# EAGLE design 3port-PicoUPS (EAGLE 8.2.2)
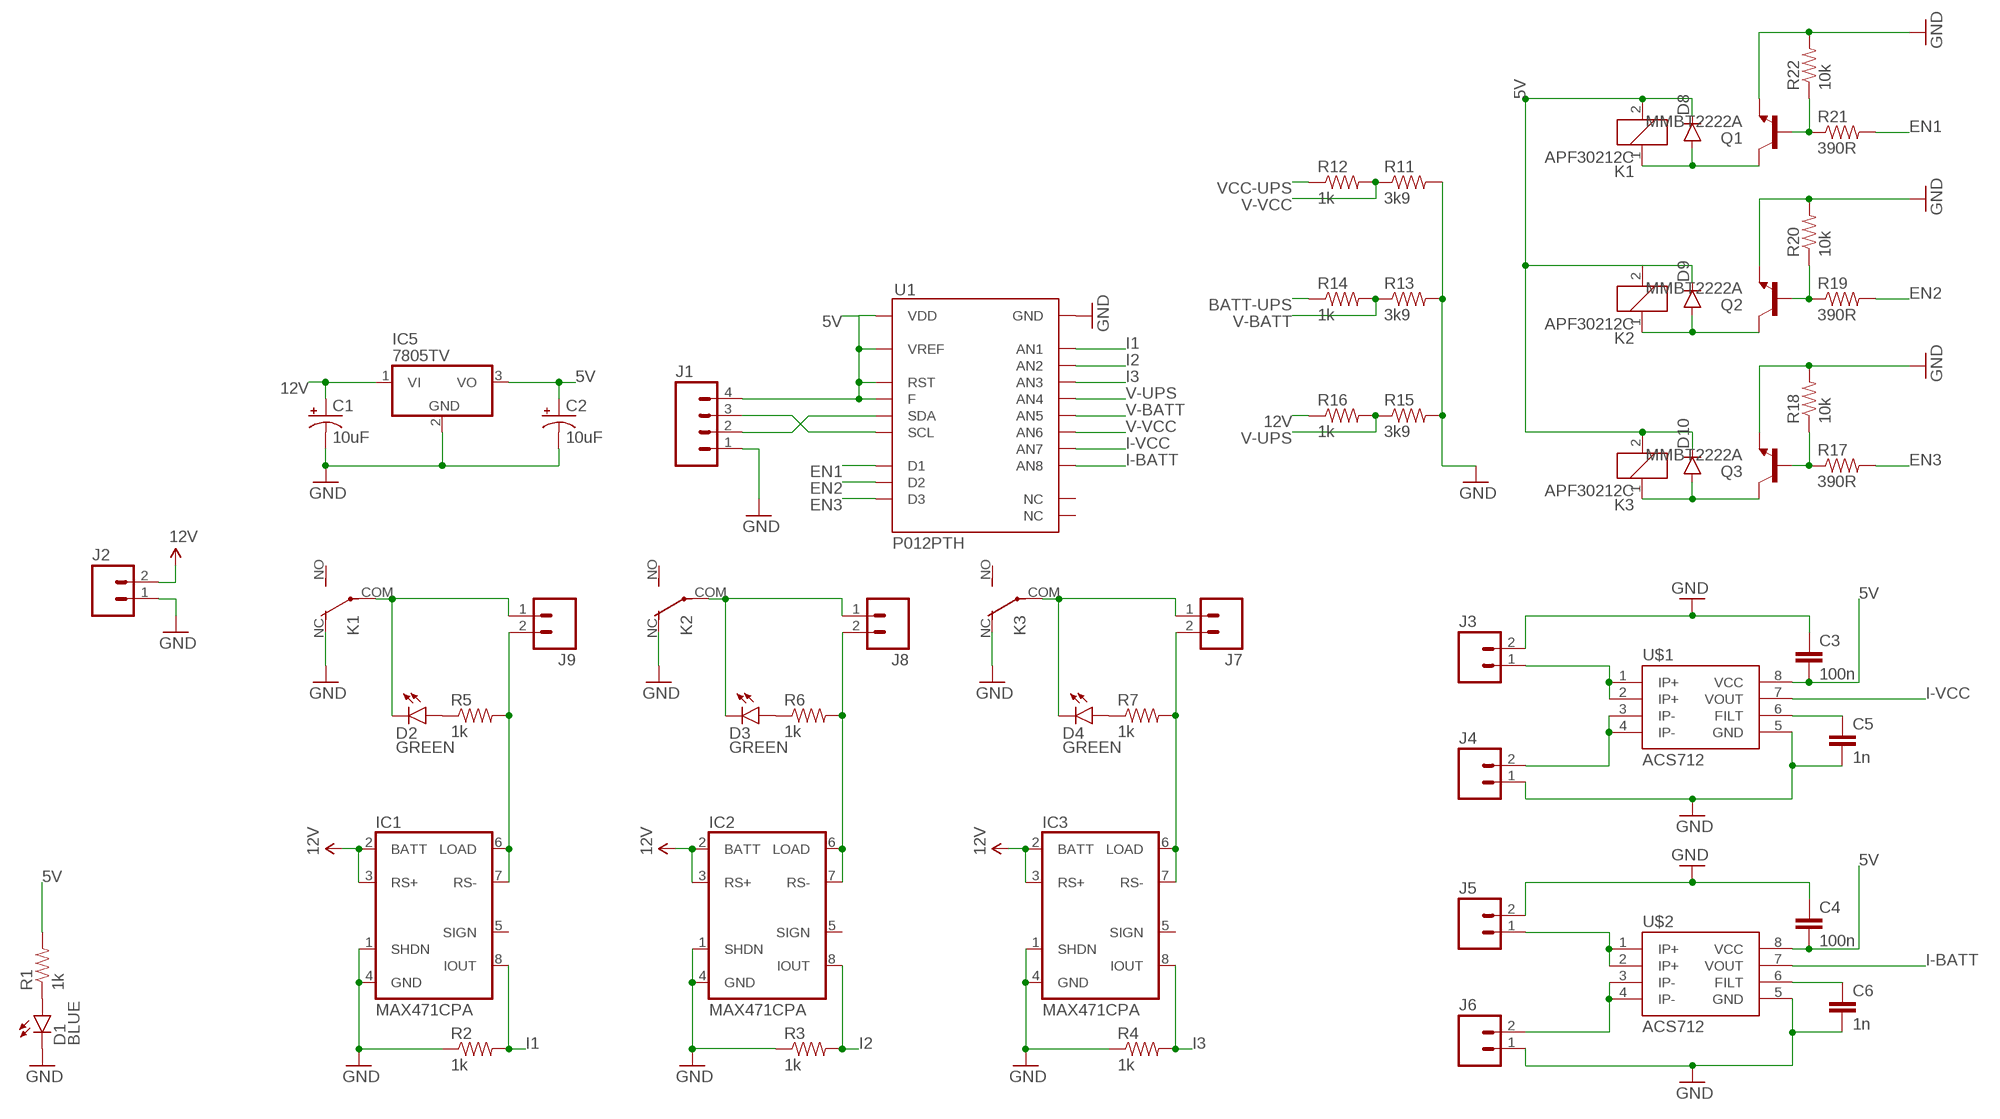
[diagram p0: schematic, sheet 1]

## Parts
C1  10uF  10UF-16V-10%(TANT)  [EIA3216]
C2  10uF  10UF-16V-10%(TANT)  [EIA3216]
C3  100n  CAP0805  [0805]
C4  100n  CAP0805  [0805]
C5  1n  CAP0805  [0805]
C6  1n  CAP0805  [0805]
D1  BLUE  LED-BLUE0603  [LED-0603]
D2  GREEN  LED-GREEN0603  [LED-0603]
D3  GREEN  LED-GREEN0603  [LED-0603]
D4  GREEN  LED-GREEN0603  [LED-0603]
D8  DIODESOD123  [SOD-123]
D9  DIODESOD123  [SOD-123]
D10  DIODESOD123  [SOD-123]
IC1  MAX471CPA  [SO08]
IC2  MAX471CPA  [SO08]
IC3  MAX471CPA  [SO08]
IC5  7805TV  [TO220V]
J1  M04PTH  [1X04]
J2  M025MM  [SCREWTERMINAL-5MM-2]
J3  M025MM  [SCREWTERMINAL-5MM-2]
J4  M025MM  [SCREWTERMINAL-5MM-2]
J5  M025MM  [SCREWTERMINAL-5MM-2]
J6  M025MM  [SCREWTERMINAL-5MM-2]
J7  M025MM  [SCREWTERMINAL-5MM-2]
J8  M025MM  [SCREWTERMINAL-5MM-2]
J9  M025MM  [SCREWTERMINAL-5MM-2]
K1  APF30212C  [APF30212C]
K2  APF30212C  [APF30212C]
K3  APF30212C  [APF30212C]
Q1  MMBT2222A  TRANSISTOR_NPNMMBT2222A  [SOT23-3]
Q2  MMBT2222A  TRANSISTOR_NPNMMBT2222A  [SOT23-3]
Q3  MMBT2222A  TRANSISTOR_NPNMMBT2222A  [SOT23-3]
R1  1k  RESISTOR0805-RES  [0805]
R2  1k  RESISTOR0805-RES  [0805]
R3  1k  RESISTOR0805-RES  [0805]
R4  1k  RESISTOR0805-RES  [0805]
R5  1k  RESISTOR0805-RES  [0805]
R6  1k  RESISTOR0805-RES  [0805]
R7  1k  RESISTOR0805-RES  [0805]
R11  3k9  RESISTOR0805-RES  [0805]
R12  1k  RESISTOR0805-RES  [0805]
R13  3k9  RESISTOR0805-RES  [0805]
R14  1k  RESISTOR0805-RES  [0805]
R15  3k9  RESISTOR0805-RES  [0805]
R16  1k  RESISTOR0805-RES  [0805]
R17  390R  RESISTOR0805-RES  [0805]
R18  10k  RESISTOR0805-RES  [0805]
R19  390R  RESISTOR0805-RES  [0805]
R20  10k  RESISTOR0805-RES  [0805]
R21  390R  RESISTOR0805-RES  [0805]
R22  10k  RESISTOR0805-RES  [0805]
U1  P012PTH  [DIL20]
U$1  ACS712  [SO08]
U$2  ACS712  [SO08]

## Nets
5V: C2.A(+) C3.2 C4.2 D8.C D9.C D10.C IC5.3(VO) J1.4 K1.2 K2.2 K3.2 R1.2 U1.1(VDD) U1.4(RST) U1.9(F) U1.18(VREF) U$1.8(VCC) U$2.8(VCC)
12V: C1.A(+) IC1.2(BATT) IC1.3(RS+) IC2.2(BATT) IC2.3(RS+) IC3.2(BATT) IC3.3(RS+) IC5.1(VI) J2.2 R16.1
BATT: J5.1 U$2.1(IP+) U$2.2(IP+)
BATT-UPS: J6.2 R14.1 U$2.3(IP-) U$2.4(IP-)
EN1: R21.2 U1.2(D1)
EN2: R19.2 U1.6(D2)
EN3: R17.2 U1.5(D3)
GND: C1.C(-) C2.C(-) C3.1 C4.1 C5.2 C6.2 D1.C IC1.1(SHDN) IC1.4(GND) IC2.1(SHDN) IC2.4(GND) IC3.1(SHDN) IC3.4(GND) IC5.2(GND) J1.1 J2.1 J3.2 J4.1 J5.2 J6.1 K1.NC(2:O) K2.NC(2:O) K3.NC(2:O) Q1.2(E) Q2.2(E) Q3.2(E) R2.1 R3.1 R4.1 R11.2 R13.2 R15.2 R18.2 R20.2 R22.2 U1.20(GND) U$1.5(GND) U$2.5(GND)
GND_6: D2.C J9.1 K1.COM(2:P)
GND_7: D3.C J8.1 K2.COM(2:P)
GND_8: D4.C J7.1 K3.COM(2:P)
I1: IC1.8(IOUT) R2.2 U1.3(AN1)
I2: IC2.8(IOUT) R3.2 U1.7(AN2)
I3: IC3.8(IOUT) R4.2 U1.8(AN3)
I-BATT: U1.19(AN8) U$2.7(VOUT)
I-VCC: U1.17(AN7) U$1.7(VOUT)
N$1: D1.A R1.1
N$2: D2.A R5.1
N$3: D3.A R6.1
N$4: D4.A R7.1
N$5: D8.A K1.1 Q1.3(C)
N$9: D9.A K2.1 Q2.3(C)
N$10: D10.A K3.1 Q3.3(C)
N$11: Q1.1(B) R21.1 R22.1
N$12: C5.1 U$1.6(FILT)
N$13: Q2.1(B) R19.1 R20.1
N$14: Q3.1(B) R17.1 R18.1
N$15: C6.1 U$2.6(FILT)
OUT1: IC1.6(LOAD) IC1.7(RS-) J9.2 R5.2
OUT2: IC2.6(LOAD) IC2.7(RS-) J8.2 R6.2
OUT3: IC3.6(LOAD) IC3.7(RS-) J7.2 R7.2
SCL: J1.3 U1.11(SCL)
SDA: J1.2 U1.13(SDA)
V-BATT: R13.1 R14.2 U1.15(AN5)
V-UPS: R15.1 R16.2 U1.14(AN4)
V-VCC: R11.1 R12.2 U1.16(AN6)
VCC: J3.1 U$1.1(IP+) U$1.2(IP+)
VCC-UPS: J4.2 R12.1 U$1.3(IP-) U$1.4(IP-)
Unconnected: IC1.5(SIGN) IC2.5(SIGN) IC3.5(SIGN) K1.NO(2:S) K2.NO(2:S) K3.NO(2:S) U1.10(NC) U1.12(NC)

## Library data of the parts
C1 C2 = SparkFun-Capacitors:10UF-16V-10%(TANT): CAP-00811 1206/EIA-3216 Tantalum capacitor; PROD_ID: CAP-00811
C3-C6 = SparkFun-Capacitors:CAP: Capacitor Standard 0603 ceramic capacitor, and 0.1" leaded capacitor.
D1 = SparkFun-LED:LED-BLUE: Blue LEDs for production use Various blue LEDs stocked by SparkFun production 0603 - DIO-08575 Rebel - DIO-09553 1206 - DIO-09911; PROD_ID: DIO-08575
D2-D4 = SparkFun-LED:LED-GREEN: Various green LEDs Green LEDs used in SFE Production 0603- DIO-00821 LARGE- DIO-00862 LILYPAD- DIO-09910; PROD_ID: DIO-00821
D8-D10 = SparkFun-DiscreteSemi:DIODE: Diode These are standard reverse protection diodes and small signal diodes. SMA package can handle up to about 1A. SOD-323 can handle about 200mA. What the SOD-323 package when ordering, there are some mfgs out there that are 5-pin packages.
IC1-IC3 = maxim:MAX471CPA: OP AMP; OC_FARNELL: unknown; OC_NEWARK: unknown
IC5 = linear:78*: Positive VOLTAGE REGULATOR Source: http://cache.national.com/ds/LM/LM78L05.pdf http://www.fairchildsemi.com/ds/LM/LM7805.pdf
J1 = SparkFun-Connectors:M04: Header 4 Standard 4-pin 0.1" header. Use with straight break away headers (SKU : PRT-00116), right angle break away headers (PRT-00553), swiss pins (PRT-00743), machine pins (PRT-00117), and female headers (PRT-00115). Molex polarized connector foot print use with SKU : PRT-08231 with associated crimp pins and housings. 1MM SMD Version SKU: PRT-10208; PROD_ID: CONN-09696
J2-J9 = SparkFun-Connectors:M02: Standard 2-pin 0.1" header. Use with - straight break away headers ( PRT-00116) - right angle break away headers (PRT-00553) - swiss pins (PRT-00743) - machine pins (PRT-00117) - female headers (PRT-00115) Molex polarized connector foot print use with: PRT-08233 with associated crimp pins and housings. 2.54_SCREWTERM for use with PRT-10571. 3.5mm Screw Terminal footprints for PRT-08084 5mm Screw Terminal footprints for use with PRT-08432; STOREFRONT_ID: PRT-08432
K1-K3 = relay:APF30212C: Compliant with European standards 1a/1c 6A Slim power relays Source: Data sheet <http://pewa.panasonic.com/assets/pcsd/catalog/pf-catalog.pdf>; OC_FARNELL: unknown
Q1-Q3 = SparkFun-DiscreteSemi:TRANSISTOR_NPN: Generic NPN BJT MMBT2222A - TRANS-08049 (SOT-23, 1A 40V) MPSA42 - TRANS-09116 (SOT-23, 500mA 300V) MMBT5088LT1G - TRANS-11160 (SOT-23, 50 mA 30V) BC547 - COM-08928 <http://www.sparkfun.com/products/8928> (TO-92 45V 100mA) (1.Collector 2.Base 3.Emitter) 2N3904 - COM-00521 <http://www.sparkfun.com/products/521> (TO-92 40V 200mA) (1.Emitter 2.Base 3.Collector) P2N2222A - COM-12852 <http://www.sparkfun.com/products/12852> (TO-92 40V 600mA) (1.Collector 2.Base 3.Emitter); PROD_ID: TRANS-08049
R1-R7 R11-R22 = SparkFun-Passives:RESISTOR: Resistor Basic schematic elements and footprints for 0603, 1206, and PTH resistors.
U1 = pim-p012:P012
U$1 U$2 = SparkFun-AnalogIC:ACS712: Hall-effect-based isolated linear current sensor; PROD_ID: IC-08964

## Board
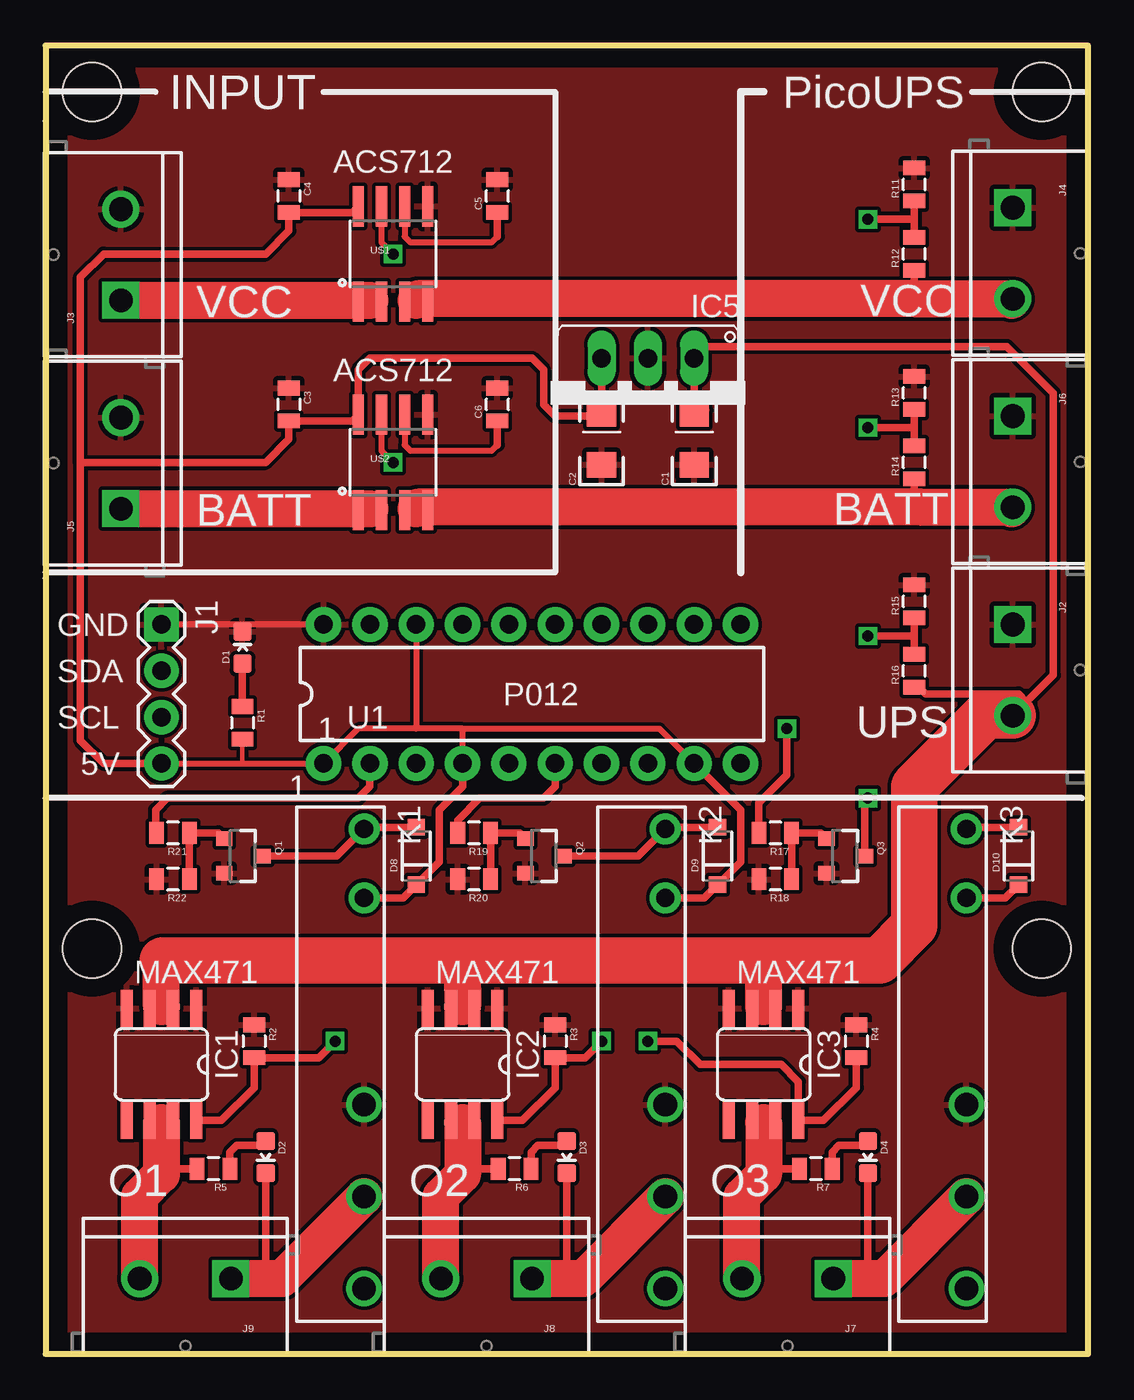
[diagram p1: board, top side]
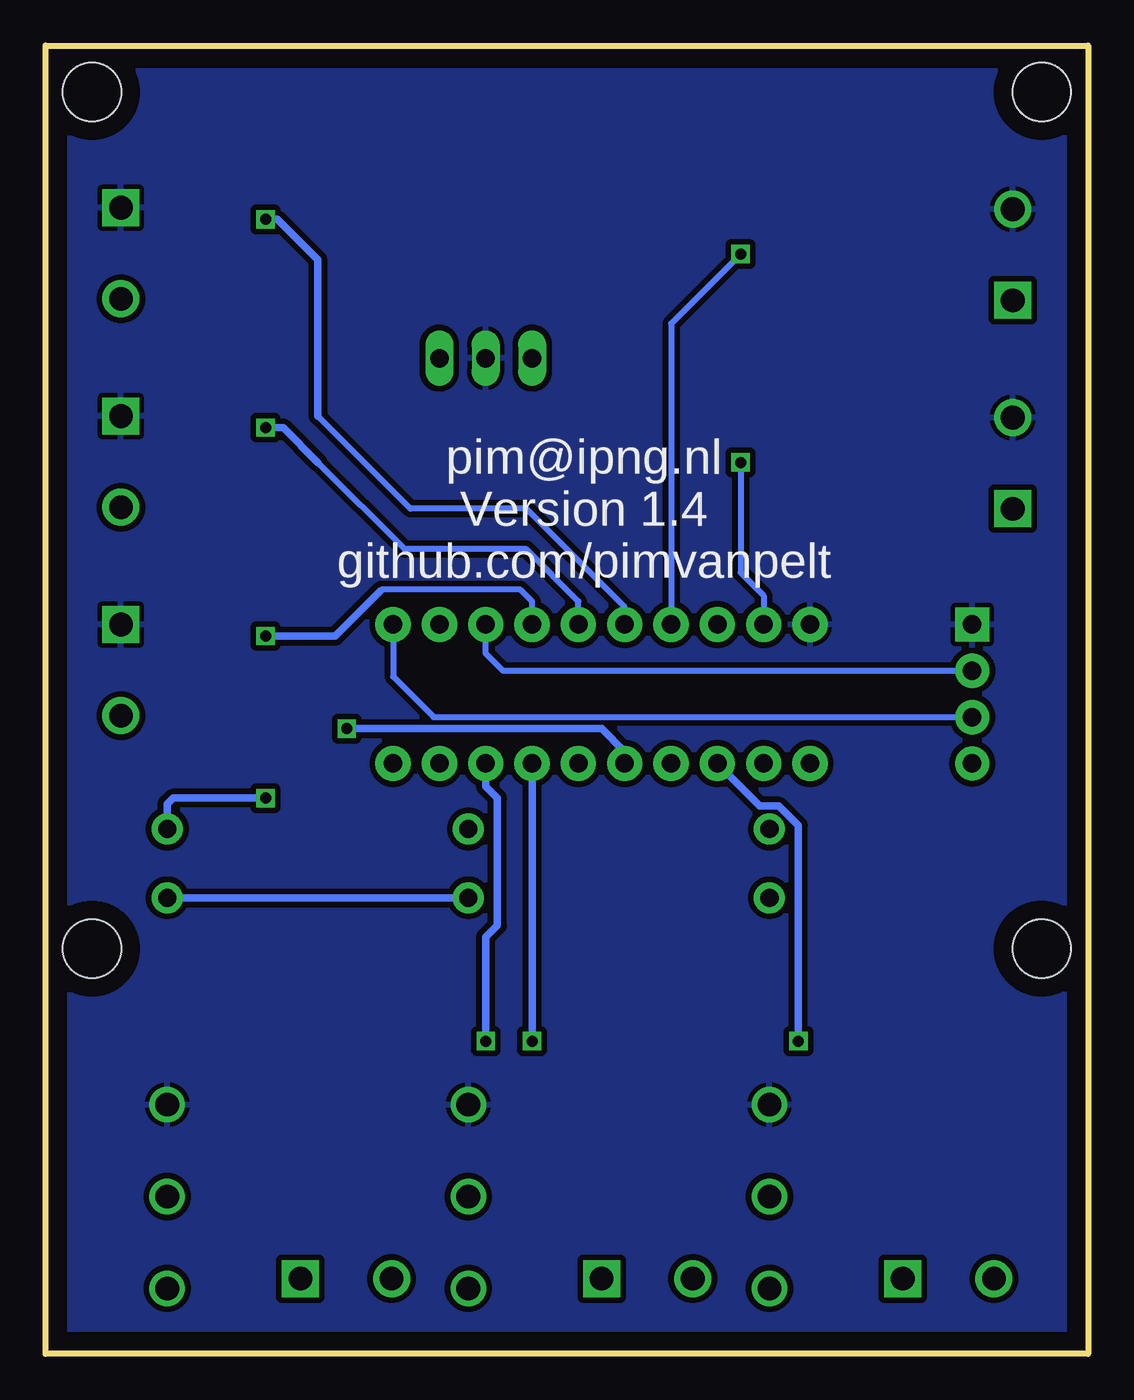
[diagram p2: board, bottom side, seen from below]

Size 57.15 x 71.76 mm. Coordinates in mm from the lower left corner, seen from the top.
Outline: 0,0 57.15,0 57.15,71.76 0,71.76 0,0
Copper layers (1*16): Top 0.035mm / dielectric 1.5mm / Bottom 0.035mm
Design rules "default *": minimum track width 10mil, minimum drill 0mil, track to track 8mil, track to pad 8mil, pad to pad 8mil, via to via 8mil, smd to smd 8mil, copper to edge 40mil, drill to drill 8mil, minimum pad ring 10mil, minimum via ring 8mil, stop-mask expansion 4mil, vias tented up to drill 0mil, thermal gap 10mil
Holes 3.2 mm at 2.54,22.23 2.54,69.22 54.61,22.23 54.61,69.22

### Footprints (pad centres in the part's own frame; a part is rotated, then mirrored left to right if it is on the bottom)
EIA3216 = smd 1.4 x 1.6: A 1.4,0; C -1.4,0
0805 = smd 0.8 x 1.2: 1 -0.9,0; 2 0.9,0
LED-0603 = smd 1 x 1: A 0,-0.877; C 0,0.877
SOD-123 = smd 0.9 x 0.95: A 1.575,0; C -1.575,0
SO08 = smd 0.66 x 2.032: 1 -1.905,-3.073; 2 -0.635,-3.073; 3 0.635,-3.073; 4 1.905,-3.073; 5 1.905,3.073; 6 0.635,3.073; 7 -0.635,3.073; 8 -1.905,3.073
TO220V = drill 1.016 long: 1 -2.54,-2.54; 2 0,-2.54; 3 2.54,-2.54
1X04 = drill 1.016 pad 1.88 square: 1 0,0 | drill 1.016 pad 1.88: 2 2.54,0; 3 5.08,0; 4 7.62,0
SCREWTERMINAL-5MM-2 = drill 1.3 pad 2.032 square: 1 0,0 | drill 1.3 pad 2.032: 2 5,0
APF30212C = drill 1 pad 1.7: 1 -12.6,0; 2 -8.82,0 | drill 1.3 pad 1.9: COM 7.56,0; NC 2.52,0; NO 12.6,0
SOT23-3 = smd 0.8 x 0.9: 1 -0.95,-1; 2 0.95,-1; 3 0,1.1
DIL20 = drill 1.016 pad 1.93: 1 -11.43,-3.81; 2 -8.89,-3.81; 3 -6.35,-3.81; 4 -3.81,-3.81; 5 -1.27,-3.81; 6 1.27,-3.81; 7 3.81,-3.81; 8 6.35,-3.81; 9 8.89,-3.81; 10 11.43,-3.81; 11 11.43,3.81; 12 8.89,3.81; 13 6.35,3.81; 14 3.81,3.81; 15 1.27,3.81; 16 -1.27,3.81; 17 -3.81,3.81; 18 -6.35,3.81; 19 -8.89,3.81; 20 -11.43,3.81
SO08' = smd 0.61 x 2.21: 1 -1.905,-2.616; 2 -0.635,-2.616; 3 0.635,-2.616; 4 1.905,-2.616; 5 1.905,2.616; 6 0.635,2.616; 7 -0.635,2.616; 8 -1.905,2.616

### Placement (x,y rotation side)
C1  35.56,50.16 90 top
C2  30.48,50.16 90 top
C3  13.34,52.07 270 top
C4  13.34,63.5 270 top
C5  24.76,63.5 90 top
C6  24.76,52.07 90 top
D1  10.79,38.73 0 top
D2  12.07,10.79 180 top
D3  28.57,10.79 180 top
D4  45.09,10.79 180 top
D8  20.32,27.3 90 top
D9  36.83,27.3 90 top
D10  53.34,27.3 90 top
IC1  6.35,15.87 180 top
IC2  22.86,15.87 180 top
IC3  39.37,15.87 180 top
IC5  33.02,52.07 180 top
J1  6.35,40 270 top
J2  53.02,40 270 top
J3  4.13,57.79 90 top
J4  53.02,62.87 270 top
J5  4.13,46.35 90 top
J6  53.02,51.43 270 top
J7  43.18,4.13 180 top
J8  26.67,4.13 180 top
J9  10.16,4.13 180 top
K1  17.46,16.19 270 top
K2  33.97,16.19 270 top
K3  50.48,16.19 270 top
Q1  10.79,27.3 270 top
Q2  27.3,27.3 270 top
Q3  43.82,27.3 270 top
R1  10.79,34.61 270 top
R2  11.43,17.14 270 top
R3  27.94,17.14 270 top
R4  44.45,17.14 270 top
R5  9.21,10.16 180 top
R6  25.72,10.16 180 top
R7  42.23,10.16 180 top
R11  47.62,64.14 90 top
R12  47.62,60.32 90 top
R13  47.62,52.7 90 top
R14  47.62,48.89 90 top
R15  47.62,41.27 90 top
R16  47.62,37.46 90 top
R17  40.01,28.57 180 top
R18  40.01,26.03 180 top
R19  23.49,28.57 180 top
R20  23.49,26.03 180 top
R21  6.98,28.57 180 top
R22  6.98,26.03 180 top
U1  26.67,36.2 0 top
U$1  ACS712  [SO08']  19.05,60.32 0 top
U$2  ACS712  [SO08']  19.05,48.89 0 top

### Tracks (layer width: path | path; a pad name or v marks a point on that pad's centre or on a via)
5V
  Top 0.254: R1.2 10.79,32.39 10.79,32.38
  Top 0.318: 22.86,34.29 33.66,34.29 35.49,32.46 U1.9 | U1.4 22.86,34.29 | 22.86,34.29 20.32,34.29 | U1.18 20.32,34.29 | 20.32,34.29 17.14,34.29 U1.1 10.79,32.38 J1.4
  Top 0.406: 20.33,25.73 D8.C | 20.33,25.73 21.59,26.99 21.59,29.84 22.86,31.11 U1.4 | K3.2 52.62,25.01 D10.C | K1.2 19.61,25.01 20.33,25.73 | K2.2 36.11,25.01 D9.C 36.84,25.73 38.1,26.99 38.1,29.84 35.49,32.46 | IC5.3 C2.A 30.35,51.43 27.94,51.43 27.3,52.07 27.3,53.97 26.67,54.61 17.78,54.61 17.14,53.97 U$2.8 16.8,51.17 C3.2 13.34,50.16 12.07,48.89 1.98,48.89 1.91,48.82 | 1.91,48.82 1.91,59.05 3.17,60.32 12.07,60.32 13.34,61.59 C4.2 16.8,62.6 U$1.8 | 1.91,48.82 1.91,33.65 3.17,32.38 J1.4
  Bottom 0.406: K3.2 K2.2
12V
  Top 0.406: 36.2,51.75 C1.A | 35.33,51.79 C1.A | C1.A IC5.1 36.2,55.24 52.71,55.24 55.25,52.7 55.25,37.23 53.78,35.76 | 52.94,34.92 J2.2 53.78,35.76 | IC1.3 6.25,18.95 6.35,19.05 6.45,18.95 IC1.2 | IC2.3 22.76,18.95 22.86,19.05 22.96,18.95 IC2.2 | IC3.3 39.27,18.95 39.37,19.05 39.47,18.95 IC3.2 40.01,20.95 39.37,21.59 | IC2.2 23.49,19.44 22.86,20.07 | IC2.2 23.49,20.95 22.86,21.59 | R16.1 47.89,36.56 48.26,36.2 53.34,36.2 53.78,35.76
  Top 2.032: 22.86,19.05 22.86,20.07 22.86,21.59 | 39.37,19.05 39.37,21.59 | 6.43,21.59 6.43,21.03 6.35,20.95 6.35,19.05
  Top 2.54: J2.2 51.52,35 47.62,31.11 47.62,23.49 45.72,21.59 39.37,21.59 22.86,21.59 6.43,21.59
BATT
  Top 0.318: U$2.1 17.22,46.35 17.78,46.35 17.86,46.28 U$2.2
  Top 2.032: J5.1 17.78,46.35
BATT-UPS
  Top 0.318: U$2.3 19.76,46.35 20.32,46.35 20.4,46.28 U$2.4
  Top 0.406: R14.1 47.62,46.87 48.06,46.43
  Top 2.032: 52.94,46.35 J6.2 48.06,46.43 20.4,46.43 20.32,46.35
EN1
  Top 0.406: U1.2 17.78,31.11 17.14,30.48 6.67,30.48 6.03,29.84 6.03,28.69 | 6.03,28.69 6.03,28.63 | R21.2 6.08,28.64 6.03,28.69
EN2
  Top 0.406: U1.6 27.94,31.11 27.3,30.48 23.81,30.48 22.59,29.26 R19.2
EN3  (via drill 0.6)
  Top 0.406: v40.64,34.29 40.64,31.75 39.11,30.21 R17.2
  Bottom 0.406: v40.64,34.29 26.67,34.29 25.4,33.02 U1.5
GND
  Top 0.318: U1.20 10.79,40 | 10.79,40 J1.1 | D1.C 10.79,40
  pour Top: 0,70.48 57.15,70.48 57.15,0 0,0
  pour Bottom (isolate 0.318): 0,70.48 57.15,70.48 57.15,0 0,0
GND_6
  Top 0.406: D2.C 12.07,5.02 12.96,4.13
  Top 2.032: J9.1 12.96,4.13 K1.COM
GND_7
  Top 0.406: D3.C 28.57,5.02 29.47,4.13
  Top 2.032: J8.1 29.47,4.13 K2.COM
GND_8
  Top 0.406: D4.C 45.09,5.02 45.98,4.13
  Top 2.032: J7.1 45.98,4.13 K3.COM
I1  (via drill 0.6)
  Top 0.406: v15.88,17.14 14.97,16.24 R2.2 11.43,14.6 9.63,12.8 IC1.8
  Bottom 0.406: U1.3 17.98,30.05 16.94,30.05 15.88,28.98 v15.88,17.14
I2  (via drill 0.6)
  Top 0.406: v30.48,17.14 29.58,16.24 R3.2 27.94,14.6 26.14,12.8 IC2.8
  Bottom 0.406: v30.48,17.14 U1.7
I3  (via drill 0.6)
  Top 0.406: 41.28,13.33 IC3.8 | v33.02,17.14 34.61,17.14 35.88,15.87 40.32,15.87 41.28,14.92 IC3.8 | IC3.8 42.65,12.8 44.45,14.6 R4.2
  Bottom 0.406: v33.02,17.14 33.02,22.86 32.38,23.49 32.38,30.48 33.02,31.11 U1.8
I-BATT  (via drill 0.6)
  Top 0.318: U$2.7 18.41,49.53 v19.05,48.89
  Bottom 0.318: v19.05,48.89 19.05,42.86 17.78,41.59 U1.19
I-VCC  (via drill 0.6)
  Top 0.318: U$1.7 18.41,60.96 v19.05,60.32
  Bottom 0.318: v19.05,60.32 22.86,56.51 U1.17
N$1
  Top 0.406: R1.1 D1.A
N$2
  Top 0.406: R5.1 10.11,11.06 10.48,11.43 11.82,11.43 D2.A
N$3
  Top 0.406: R6.1 26.62,11.06 26.99,11.43 28.33,11.43 D3.A
N$4
  Top 0.406: R7.1 43.13,11.06 43.5,11.43 44.84,11.43 D4.A
N$5
  Top 0.406: Q1.3 15.97,27.3 17.45,28.78 | 17.45,28.78 K1.1 | D8.A 17.55,28.88 17.45,28.78
N$9
  Top 0.406: Q2.3 32.48,27.3 33.92,28.74 | 33.92,28.74 K2.1 | D9.A 34.06,28.88 33.92,28.74
N$10  (via drill 0.6)
  Top 0.406: D10.A 50.57,28.88 K3.1 | 44.77,27.45 Q3.3 44.91,30.31 v45.09,30.48
  Bottom 0.406: v45.09,30.48 50.16,30.48 50.48,30.16 K3.1
N$11
  Top 0.406: 9.47,28.57 Q1.1 9.47,28.57 | R22.1 R21.1 9.47,28.57
N$12
  Top 0.318: U$1.6 19.68,61.28 20,60.96 24.45,60.96 24.76,61.28
  Top 0.406: 24.76,61.28 C5.1
N$13
  Top 0.406: Q2.1 25.98,28.57 R19.1 R20.1
N$14
  Top 0.406: 42.77,28.3 42.5,28.57 | 42.77,28.3 Q3.1 | R18.1 R17.1 42.5,28.57 | 42.5,28.57 42.77,28.3
N$15
  Top 0.318: U$2.6 19.68,49.85 20,49.53 24.45,49.53 24.76,49.85
  Top 0.406: 24.76,49.85 C6.1
OUT1
  Top 0.406: IC1.6 6.25,12.8 6.35,12.7 6.45,12.8 IC1.7 | R5.2 6.67,10.16 6.35,9.84
  Top 2.032: J9.2 5.16,8.65 6.35,9.84 6.35,12.7
OUT2
  Top 0.406: 22.76,12.8 IC2.6 | 22.76,12.8 22.86,12.7 | IC2.7 22.76,12.8 | R6.2 23.18,10.16 22.86,9.84
  Top 2.032: J8.2 21.67,8.65 22.86,9.84 22.86,12.7
OUT3
  Top 0.406: IC3.6 39.27,12.8 39.37,12.7 39.47,12.8 IC3.7 | R7.2 39.69,10.16 39.37,9.84
  Top 2.032: J7.2 38.18,8.65 39.37,9.84 39.37,12.7
SCL
  Bottom 0.318: U1.11 38.1,37.15 35.88,34.92 J1.3
SDA
  Bottom 0.318: J1.2 32.07,37.46 33.02,38.42 U1.13
V-BATT  (via drill 0.6)
  Top 0.406: R13.1 47.62,50.8 | 47.62,50.8 R14.2 | 47.62,50.8 v45.09,50.8
  Bottom 0.318: U1.15 27.94,41.27 30.8,44.13 37.47,44.13 42.23,48.89
  Bottom 0.406: v45.09,50.8 44.13,50.8 42.23,48.89
V-UPS  (via drill 0.6)
  Top 0.406: R15.1 47.62,39.37 | 47.62,39.37 R16.2 | 47.62,39.37 v45.09,39.37
  Bottom 0.318: U1.14 30.48,41.27 31.11,41.91 38.73,41.91 38.81,41.84
  Bottom 0.406: v45.09,39.37 41.28,39.37 38.81,41.84
V-VCC  (via drill 0.6)
  Top 0.406: R11.1 47.62,62.23 | 47.62,62.23 R12.2 | 47.62,62.23 v45.09,62.23
  Bottom 0.318: U1.16 25.4,40.96 30.8,46.35 37.15,46.35 42.23,51.43
  Bottom 0.406: 42.23,51.43 42.23,60.01 44.45,62.23 v45.09,62.23
VCC
  Top 0.318: U$1.1 17.22,57.79 17.78,57.79 18.41,57.79 U$1.2
  Top 2.032: J3.1 17.78,57.79
VCC-UPS
  Top 0.406: 20.24,57.71 U$1.3 | 20.32,57.79 20.24,57.71 | U$1.4 20.24,57.71 | R12.1 47.62,58 47.76,57.87
  Top 2.032: 52.94,57.79 J4.2 47.76,57.87 20.4,57.87 20.32,57.79

### Text on the board
tPlace: INPUT | PicoUPS | ACS712 | VCC | VCC | ACS712 | BATT | BATT | GND | SDA | P012 | UPS | SCL | 1 | 5V | 1 | MAX471 | MAX471 | MAX471 | O1 | O2 | O3
bPlace: pim@ipng.nl / Version 1.4 / github.com/pimvanpelt